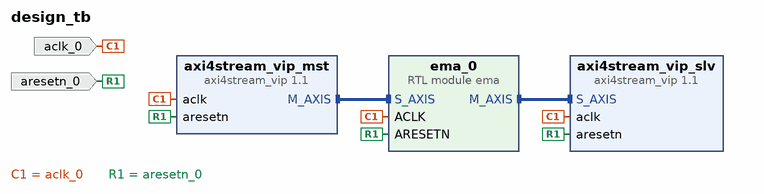
[diagram p0: block diagram of the top level]
# Vivado block design design_tb, xc7z020clg400-1, Vivado 2018.3
create_bd_design design_tb

create_bd_port -dir I -type clk aclk_0
create_bd_port -dir I -type rst aresetn_0

create_bd_cell -type ip -vlnv xilinx.com:ip:axi4stream_vip:1.1 axi4stream_vip_mst
set_property -dict [list \
  CONFIG.HAS_TKEEP 0 \
  CONFIG.HAS_TLAST 0 \
  CONFIG.HAS_TREADY 1 \
  CONFIG.HAS_TSTRB 0 \
  CONFIG.INTERFACE_MODE MASTER \
  CONFIG.TDATA_NUM_BYTES 4 \
  CONFIG.TDEST_WIDTH 0 \
  CONFIG.TID_WIDTH 0 \
  CONFIG.TUSER_WIDTH 0 \
] [get_bd_cells axi4stream_vip_mst]
create_bd_cell -type ip -vlnv xilinx.com:ip:axi4stream_vip:1.1 axi4stream_vip_slv
set_property -dict {CONFIG.INTERFACE_MODE SLAVE} [get_bd_cells axi4stream_vip_slv]
create_bd_cell -type module -reference ema ema_0

# ---- connections ----

connect_bd_intf_net [get_bd_intf_pins axi4stream_vip_slv/S_AXIS] [get_bd_intf_pins ema_0/M_AXIS]
connect_bd_intf_net [get_bd_intf_pins axi4stream_vip_mst/M_AXIS] [get_bd_intf_pins ema_0/S_AXIS]
connect_bd_net -net aclk_0_1 [get_bd_ports aclk_0] \
  [get_bd_pins axi4stream_vip_slv/aclk] [get_bd_pins axi4stream_vip_mst/aclk] [get_bd_pins ema_0/ACLK]
connect_bd_net -net aresetn_0_1 [get_bd_ports aresetn_0] \
  [get_bd_pins axi4stream_vip_slv/aresetn] [get_bd_pins axi4stream_vip_mst/aresetn] [get_bd_pins ema_0/ARESETN]

validate_bd_design
save_bd_design
